# Altium schematic sheet PCB_Botny.SchDoc
size A
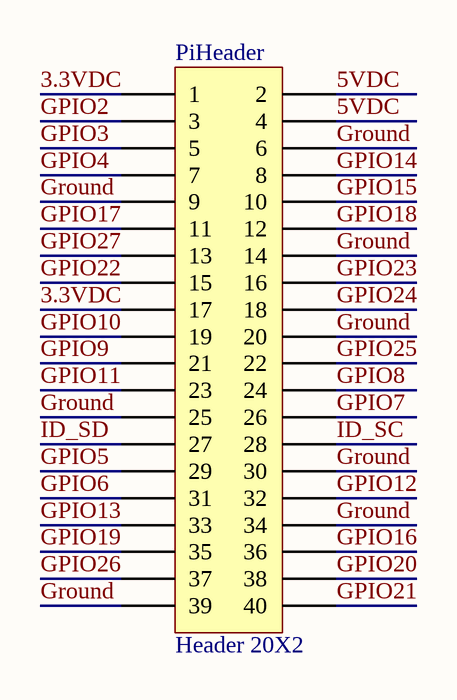
[diagram p0: PCB_Botny.SchDoc]

## Parts
PiHeader  Header 20X2  [HDR2X20]

## Nets
3.3VDC: PiHeader.1 PiHeader.17
5VDC: PiHeader.2 PiHeader.4
GPIO2: PiHeader.3
GPIO3: PiHeader.5
GPIO4: PiHeader.7
GPIO5: PiHeader.29
GPIO6: PiHeader.31
GPIO7: PiHeader.26
GPIO8: PiHeader.24
GPIO9: PiHeader.21
GPIO10: PiHeader.19
GPIO11: PiHeader.23
GPIO12: PiHeader.32
GPIO13: PiHeader.33
GPIO14: PiHeader.8
GPIO15: PiHeader.10
GPIO16: PiHeader.36
GPIO17: PiHeader.11
GPIO18: PiHeader.12
GPIO19: PiHeader.35
GPIO20: PiHeader.38
GPIO21: PiHeader.40
GPIO22: PiHeader.15
GPIO23: PiHeader.16
GPIO24: PiHeader.18
GPIO25: PiHeader.22
GPIO26: PiHeader.37
GPIO27: PiHeader.13
Ground: PiHeader.6 PiHeader.9 PiHeader.14 PiHeader.20 PiHeader.25 PiHeader.30 PiHeader.34 PiHeader.39
ID_SC: PiHeader.28
ID_SD: PiHeader.27

## Library data of the parts
PiHeader = Header 20X2: Header, 20-Pin, Dual row; LatestRevisionDate: 17-Jul-2002; LatestRevisionNote: Re-released for DXP Platform.; Publisher: Altium Limited